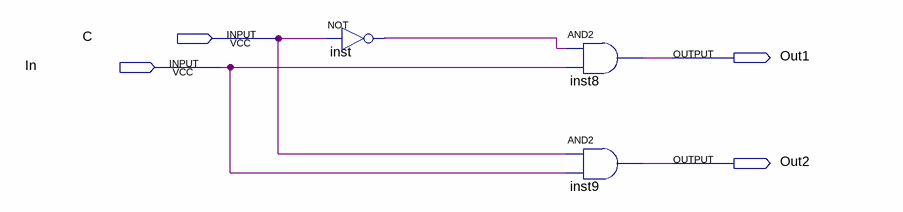
[diagram p0: schematic sheet]
// Quartus schematic 1to2DeMUX.bdf as structural Verilog: 3 symbols, 4 pins
module \1to2DeMUX  (
  input  C,
  input  In,
  output Out1,
  output Out2
);

  wire inst_out;

  not inst (inst_out, C);
  and inst8 (Out1, inst_out, In);
  and inst9 (Out2, C, In);
endmodule
